# EAGLE design Pro Trinket Keyboard V4.2 (EAGLE 7.4.0)
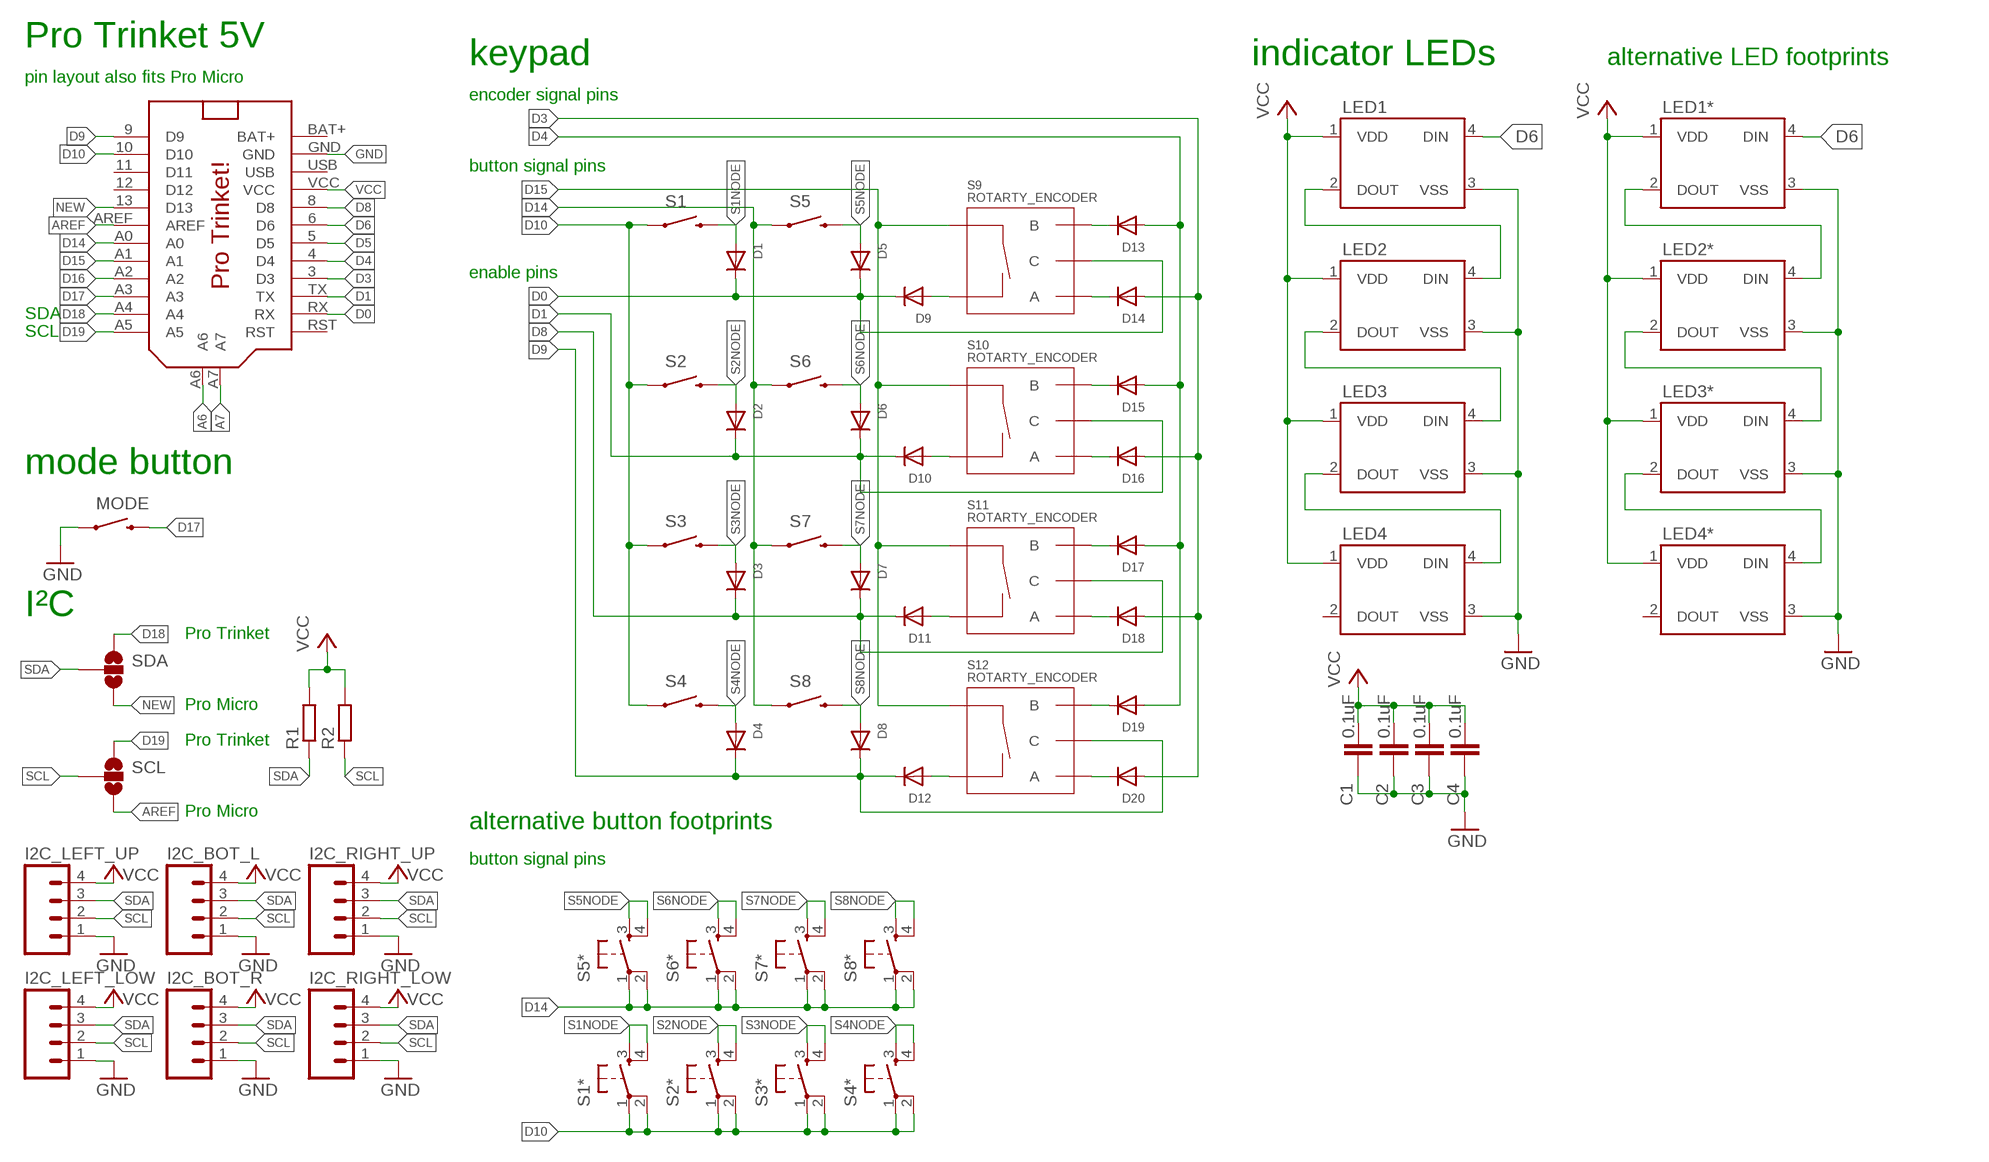
[diagram p0: schematic, sheet 1]

## Parts
C1  0.1uF  22PF-50V-5%(0603)  [0603-CAP]
C2  0.1uF  22PF-50V-5%(0603)  [0603-CAP]
C3  0.1uF  22PF-50V-5%(0603)  [0603-CAP]
C4  0.1uF  22PF-50V-5%(0603)  [0603-CAP]
D1  DIODESOD-123  [SOD-123]
D2  DIODESOD-123  [SOD-123]
D3  DIODESOD-123  [SOD-123]
D4  DIODESOD-123  [SOD-123]
D5  DIODESOD-123  [SOD-123]
D6  DIODESOD-123  [SOD-123]
D7  DIODESOD-123  [SOD-123]
D8  DIODESOD-123  [SOD-123]
D9  DIODESOD-123  [SOD-123]
D10  DIODESOD-123  [SOD-123]
D11  DIODESOD-123  [SOD-123]
D12  DIODESOD-123  [SOD-123]
D13  DIODESOD-123  [SOD-123]
D14  DIODESOD-123  [SOD-123]
D15  DIODESOD-123  [SOD-123]
D16  DIODESOD-123  [SOD-123]
D17  DIODESOD-123  [SOD-123]
D18  DIODESOD-123  [SOD-123]
D19  DIODESOD-123  [SOD-123]
D20  DIODESOD-123  [SOD-123]
I2C_BOT_L  M04PTH  [1X04]
I2C_BOT_R  M04PTH  [1X04]
I2C_LEFT_LOW  M04PTH  [1X04]
I2C_LEFT_UP  M04PTH  [1X04]
I2C_RIGHT_LOW  M04PTH  [1X04]
I2C_RIGHT_UP  M04PTH  [1X04]
LED1  WS2812B  [WS2812B]
LED1*  WS2812B  [WS2812B]
LED2  WS2812B  [WS2812B]
LED2*  WS2812B  [WS2812B]
LED3  WS2812B  [WS2812B]
LED3*  WS2812B  [WS2812B]
LED4  WS2812B  [WS2812B]
LED4*  WS2812B  [WS2812B]
MODE  SWITCH-MOMENTARY-2SIDE_EZ  [TACTILE-PTH-SIDEEZ]
PRO_TRINKET  PRO_TRINKET  [PROTRINKET]
R1  RESISTORR805-0805  [R805]
R2  RESISTORR805-0805  [R805]
S1  SWITCH-MOMENTARY-212MM  [TACTILE-PTH-12MM]
S1*  TACTILE-SWITCH-PTH  [TAC-SWITCH-PTH]
S2  SWITCH-MOMENTARY-212MM  [TACTILE-PTH-12MM]
S2*  TACTILE-SWITCH-PTH  [TAC-SWITCH-PTH]
S3  SWITCH-MOMENTARY-212MM  [TACTILE-PTH-12MM]
S3*  TACTILE-SWITCH-PTH  [TAC-SWITCH-PTH]
S4  SWITCH-MOMENTARY-212MM  [TACTILE-PTH-12MM]
S4*  TACTILE-SWITCH-PTH  [TAC-SWITCH-PTH]
S5  SWITCH-MOMENTARY-212MM  [TACTILE-PTH-12MM]
S5*  TACTILE-SWITCH-PTH  [TAC-SWITCH-PTH]
S6  SWITCH-MOMENTARY-212MM  [TACTILE-PTH-12MM]
S6*  TACTILE-SWITCH-PTH  [TAC-SWITCH-PTH]
S7  SWITCH-MOMENTARY-212MM  [TACTILE-PTH-12MM]
S7*  TACTILE-SWITCH-PTH  [TAC-SWITCH-PTH]
S8  SWITCH-MOMENTARY-212MM  [TACTILE-PTH-12MM]
S8*  TACTILE-SWITCH-PTH  [TAC-SWITCH-PTH]
S9  ROTARTY_ENCODER  [ROTARY_ENC_PLAIN]
S10  ROTARTY_ENCODER  [ROTARY_ENC_PLAIN]
S11  ROTARTY_ENCODER  [ROTARY_ENC_PLAIN]
S12  ROTARTY_ENCODER  [ROTARY_ENC_PLAIN]
SCL  SOLDERJUMPER_2WAYS  [SJ_3]
SDA  SOLDERJUMPER_2WAYS  [SJ_3]

## Nets
A6: PRO_TRINKET.A6
A7: PRO_TRINKET.A7
AREF: PRO_TRINKET.AREF SCL.3
D0: D1.C D5.C D9.C PRO_TRINKET.RX S9.C
D1: D2.C D6.C D10.C PRO_TRINKET.TX S10.C
D3: D14.A D16.A D18.A D20.A PRO_TRINKET.3(D3)
D4: D13.A D15.A D17.A D19.A PRO_TRINKET.4(D4)
D5: PRO_TRINKET.5(D5)
D6: LED1*.4(DIN) LED1.4(DIN) PRO_TRINKET.6(D6)
D8: D3.C D7.C D11.C PRO_TRINKET.8(D8) S11.C
D9: D4.C D8.C D12.C PRO_TRINKET.9(D9) S12.C
D10: PRO_TRINKET.10(D10) S1*.1 S1*.2 S1.1 S1.2 S2*.1 S2*.2 S2.1 S2.2 S3*.1 S3*.2 S3.1 S3.2 S4*.1 S4*.2 S4.1 S4.2
D14: PRO_TRINKET.A0 S5*.1 S5*.2 S5.1 S5.2 S6*.1 S6*.2 S6.1 S6.2 S7*.1 S7*.2 S7.1 S7.2 S8*.1 S8*.2 S8.1 S8.2
D15: PRO_TRINKET.A1 S9.SW+ S10.SW+ S11.SW+ S12.SW+
D16: PRO_TRINKET.A2
D17: MODE.2 PRO_TRINKET.A3
D18: PRO_TRINKET.A4 SDA.1
D19: PRO_TRINKET.A5 SCL.1
GND: C1.1 C2.1 C3.1 C4.1 I2C_BOT_L.1 I2C_BOT_R.1 I2C_LEFT_LOW.1 I2C_LEFT_UP.1 I2C_RIGHT_LOW.1 I2C_RIGHT_UP.1 LED1*.3(VSS) LED1.3(VSS) LED2*.3(VSS) LED2.3(VSS) LED3*.3(VSS) LED3.3(VSS) LED4*.3(VSS) LED4.3(VSS) MODE.1 PRO_TRINKET.GND
L1NODE: LED1*.2(DOUT) LED1.2(DOUT) LED2*.4(DIN) LED2.4(DIN)
L2NODE: LED2*.2(DOUT) LED2.2(DOUT) LED3*.4(DIN) LED3.4(DIN)
L3NODE: LED3*.2(DOUT) LED3.2(DOUT) LED4*.4(DIN) LED4.4(DIN)
N$34: D10.A S10.SW-
N$35: D9.A S9.SW-
N$36: D11.A S11.SW-
N$37: D20.C S12.A
N$38: D19.C S12.B
N$39: D18.C S11.A
N$40: D12.A S12.SW-
N$41: D16.C S10.A
N$42: D15.C S10.B
N$43: D14.C S9.A
N$44: D13.C S9.B
N$45: D17.C S11.B
NEW: PRO_TRINKET.13(D13) SDA.3
S1NODE: D1.A S1*.3 S1*.4 S1.3 S1.4
S2NODE: D2.A S2*.3 S2*.4 S2.3 S2.4
S3NODE: D3.A S3*.3 S3*.4 S3.3 S3.4
S4NODE: D4.A S4*.3 S4*.4 S4.3 S4.4
S5NODE: D5.A S5*.3 S5*.4 S5.3 S5.4
S6NODE: D6.A S6*.3 S6*.4 S6.3 S6.4
S7NODE: D7.A S7*.3 S7*.4 S7.3 S7.4
S8NODE: D8.A S8*.3 S8*.4 S8.3 S8.4
SCL: I2C_BOT_L.2 I2C_BOT_R.2 I2C_LEFT_LOW.2 I2C_LEFT_UP.2 I2C_RIGHT_LOW.2 I2C_RIGHT_UP.2 R2.1 SCL.2
SDA: I2C_BOT_L.3 I2C_BOT_R.3 I2C_LEFT_LOW.3 I2C_LEFT_UP.3 I2C_RIGHT_LOW.3 I2C_RIGHT_UP.3 R1.1 SDA.2
VCC: C1.2 C2.2 C3.2 C4.2 I2C_BOT_L.4 I2C_BOT_R.4 I2C_LEFT_LOW.4 I2C_LEFT_UP.4 I2C_RIGHT_LOW.4 I2C_RIGHT_UP.4 LED1*.1(VDD) LED1.1(VDD) LED2*.1(VDD) LED2.1(VDD) LED3*.1(VDD) LED3.1(VDD) LED4*.1(VDD) LED4.1(VDD) PRO_TRINKET.VCC R1.2 R2.2
Unconnected: LED4*.2(DOUT) LED4.2(DOUT) PRO_TRINKET.11(D11) PRO_TRINKET.12(D12) PRO_TRINKET.RST

## Notes on the sheet
- Pro Trinket 5V
- keypad | indicator LEDs | alternative LED footprints
- pin layout also fits Pro Micro
- encoder signal pins
- button signal pins
- enable pins
- SDA
- SCL
- mode button
- I²C
- Pro Trinket
- Pro Micro
- Pro Trinket
- Pro Micro
- alternative button footprints
- button signal pins

## Power pins joined to a net without a drawn wire
BAT+: PRO_TRINKET.BAT+
USB: PRO_TRINKET.USB

## Library data of the parts
C1-C4 = SparkFun-Capacitors:22PF-50V-5%(0603): CAP-07876; PROD_ID: CAP-07876; VALUE: 22pF
D1-D20 = adafruit:DIODE: Diode SMADIODE - SMA Surface Mount Package 20V 1A Schottky Diode Digikey: 641-1014-6-ND DO-1N4148 - Through Hole Small Current Diode SOD-123 20V 1 A (.5mV Vf) Schottky Diode - Digikey: MBRX120TPMSCT-ND SOD-323 10V 570mA (.38mV Vf, 3ns) Schottky Diode - Digikey: ZLLS410CT-ND SOD-523 30V 30mA Schottky Diode (RB751S-40TE61) - Digikey: RB751S-40TE61CT-ND SOT23-R/W - SOT23 Package (R = Solder Paste/Reflow Ovens, W = Hand-Soldering) BAT54Film 40V 300mA - Digikey: 497-7162-1-ND
I2C_BOT_L I2C_BOT_R I2C_LEFT_LOW I2C_LEFT_UP I2C_RIGHT_LOW I2C_RIGHT_UP = SparkFun-Connectors:M04: Header 4 Standard 4-pin 0.1" header. Use with straight break away headers (SKU : PRT-00116), right angle break away headers (PRT-00553), swiss pins (PRT-00743), machine pins (PRT-00117), and female headers (PRT-00115). Molex polarized connector foot print use with SKU : PRT-08231 with associated crimp pins and housings. 1MM SMD Version SKU: PRT-10208
LED1 LED1* LED2 LED2* LED3 LED3* LED4 LED4* = SparkFun-LED:WS2812B: WS2812B - Intelligent control LED integrated light source Technical Specifications: Power Supply Voltage (VDD): 3.5 to 5.3 V Input Voltage (VI): -0.5 to VDD+0.5 V Operating Junction Temperature (Topt): -25°C to +80°C Storage Temperature Range (Tstg): -55°C to +150°C
MODE = SparkFun-Electromechanical:SWITCH-MOMENTARY-2: Various NO switches- pushbuttons, reed, etc
PRO_TRINKET = adafruit:PRO_TRINKET
R1 R2 = dp_devices:RESISTOR
S1-S8 = SparkFun-Electromechanical:SWITCH-MOMENTARY-2: Various NO switches- pushbuttons, reed, etc; PROD_ID: SWCH-09185
S1* S2* S3* S4* S5* S6* S7* S8* = GeekAmmo:TACTILE-SWITCH: Tactile Switch 4 Pins, SPST NO
S9-S12 = SparkFun-Electromechanical:ROTARTY_ENCODER: Simple no LED rotary encoder Example: COM-09117
SCL SDA = SparkFun-Retired:SOLDERJUMPER_2WAY: Solder Jumper 2 way solder jumper

## Board
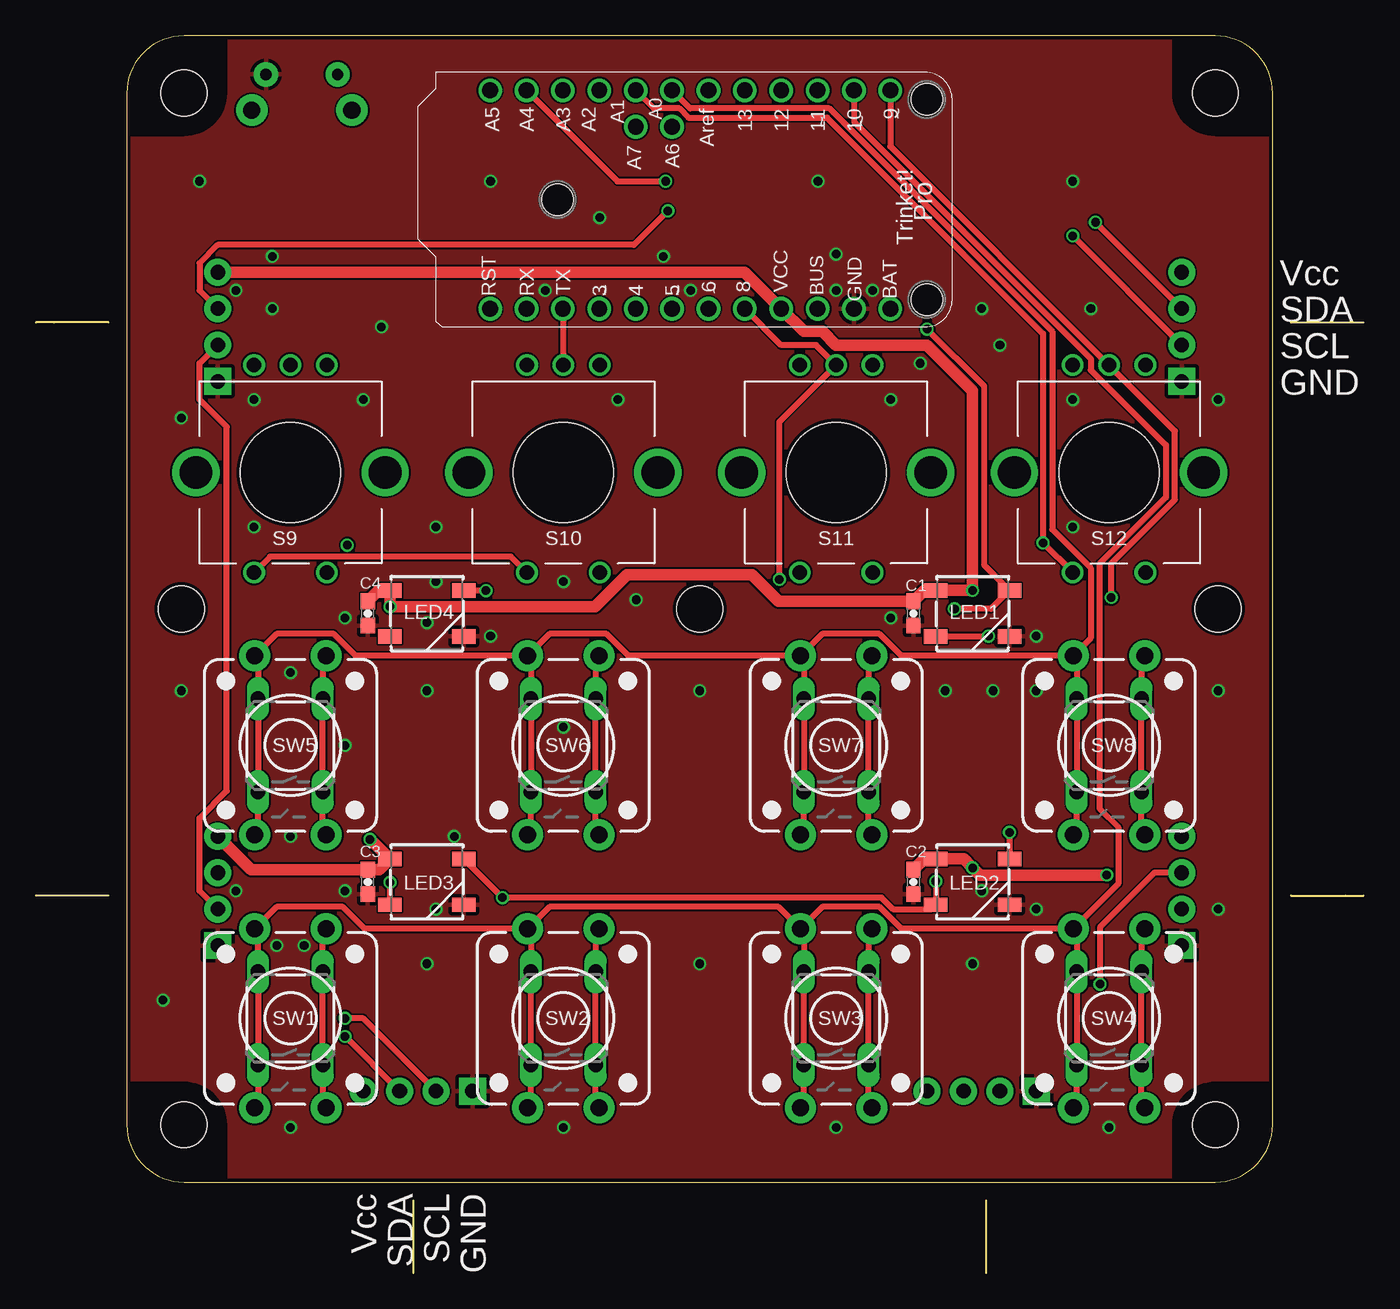
[diagram p1: board, top side]
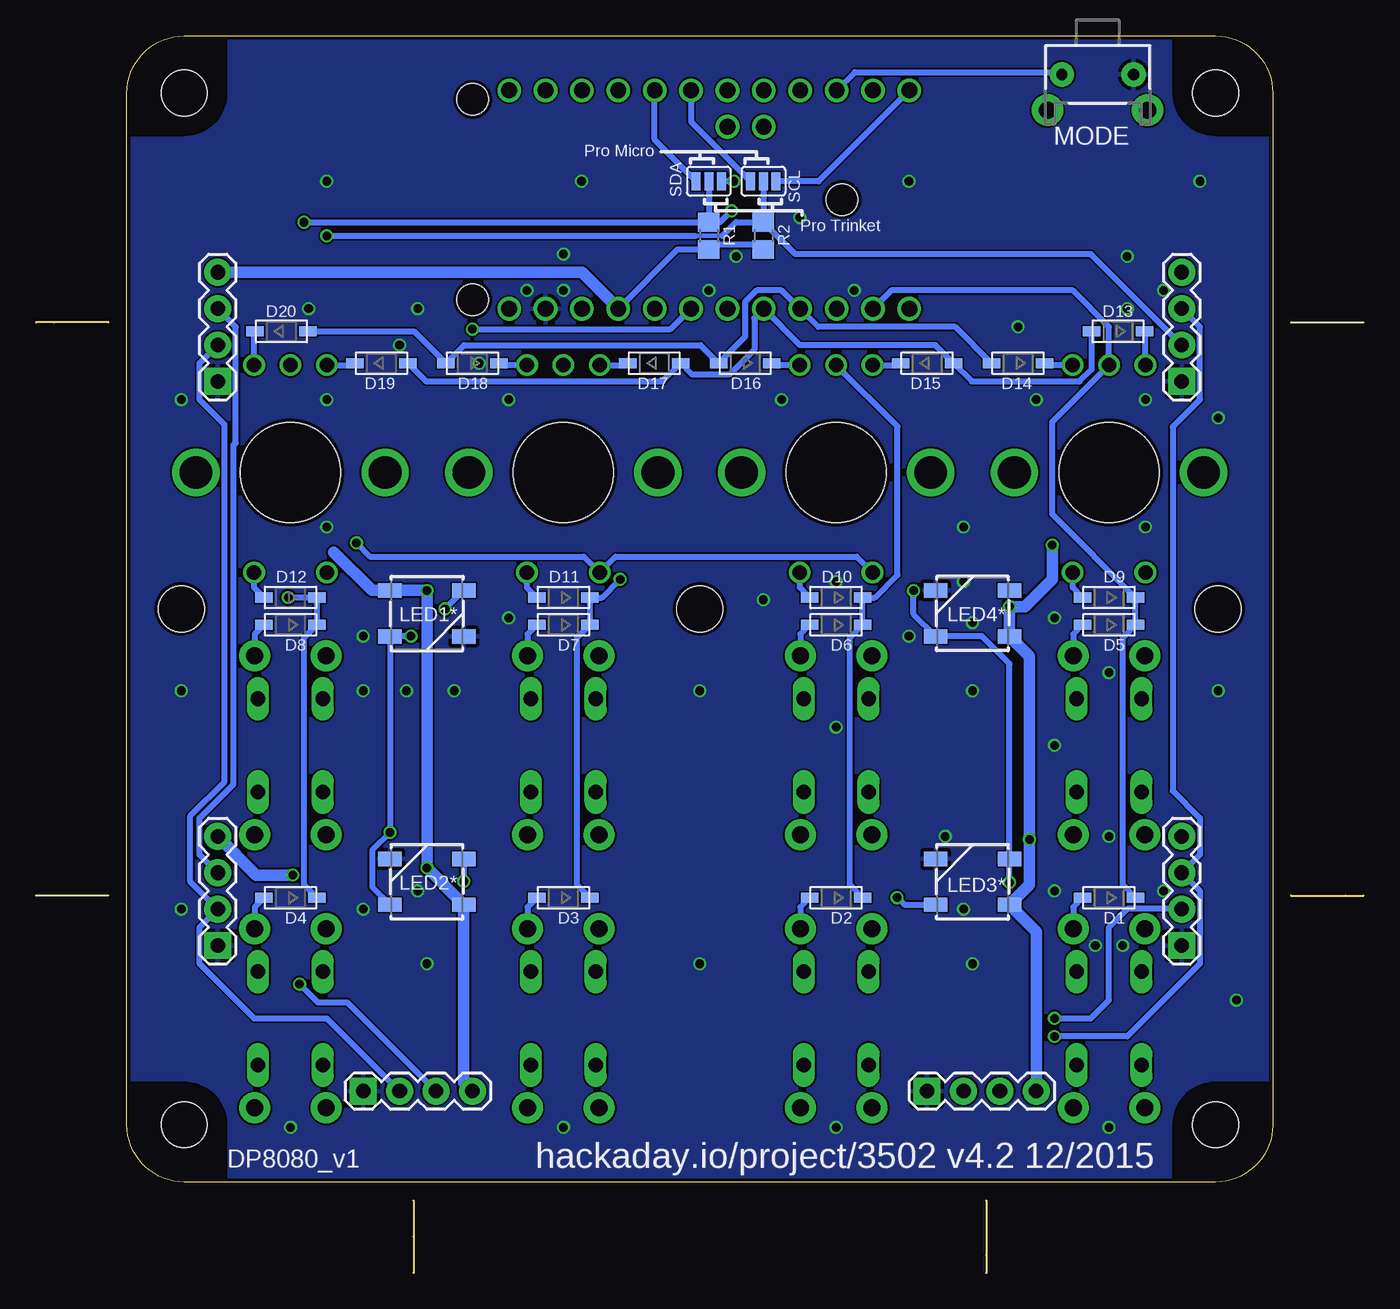
[diagram p2: board, bottom side, seen from below]

Size 80 x 80 mm. Coordinates in mm from the lower left corner, seen from the top.
Copper layers (1*16): Top 0.035mm / dielectric 1.5mm / Bottom 0.035mm
Design rules "dirt_cheap_dirty_boards.v1": minimum track width 5mil, minimum drill 12mil, track to track 5mil, track to pad 5mil, pad to pad 5mil, via to via 5mil, smd to smd 0mil, copper to edge 10mil, drill to drill 10mil, minimum pad ring 10mil, minimum via ring 6mil, stop-mask expansion 2mil, vias tented up to drill 25mil, thermal gap 10mil
Holes 7 mm at 11.43,49.53 30.48,49.53 49.53,49.53 68.58,49.53
Holes 3.2 mm at 40.01,40.01 3.81,40.01 76.2,40.01

### Footprints (pad centres in the part's own frame; a part is rotated, then mirrored left to right if it is on the bottom)
0603-CAP = smd 1.1 x 1: 1 -0.85,0; 2 0.85,0
SOD-123 = smd 1.2 x 0.7: A 1.85,0; C -1.85,0
1X04 = drill 1.016 pad 1.88 square: 1 0,0 | drill 1.016 pad 1.88: 2 2.54,0; 3 5.08,0; 4 7.62,0
WS2812B = smd 1.651 x 1: 1 -2.577,1.6; 2 -2.577,-1.6; 3 2.577,-1.6; 4 2.577,1.6
TACTILE-PTH-SIDEEZ = drill 0.8 pad 1.7: 1 -2.5,0; 2 2.5,0 | drill 1.2 pad 2.2: ANCHOR1 -3.5,2.5; ANCHOR2 3.5,2.5
PROTRINKET = drill 1.1: 3 7.62,2.921; 4 7.62,5.461; 5 7.62,8.001; 6 7.62,10.541; 8 7.62,13.081; 9 -7.62,23.241; 10 -7.62,20.701; 11 -7.62,18.161; 12 -7.62,15.621; 13 -7.62,13.081; A0 -7.62,8.001; A1 -7.62,5.461; A2 -7.62,2.921; A3 -7.62,0.381; A4 -7.62,-2.159; A5 -7.62,-4.699; A6 -5.08,8.001; A7 -5.08,5.461; AREF -7.62,10.541; BAT+ 7.62,23.241; GND 7.62,20.701; RST 7.62,-4.699; RX 7.62,-2.159; TX 7.62,0.381; USB 7.62,18.161; VCC 7.62,15.621 | hole 2.2: -6.985,25.781; 6.985,25.781; 0,0
R805 = smd 1.3 x 1.5: 1 -0.95,0; 2 0.95,0
TACTILE-PTH-12MM = drill 1.2 pad 2.159: 1 6.25,-2.5; 2 -6.25,-2.5; 3 6.25,2.5; 4 -6.25,2.5
TAC-SWITCH-PTH = drill 1.016 pad 1.524 long: 1 -3.251,2.261; 2 3.251,2.261; 3 -3.251,-2.261; 4 3.251,-2.261
ROTARY_ENC_PLAIN = drill 1.016: A 7.493,-2.54; B 7.493,2.54; C 7.493,0; SW+ -6.985,2.54; SW- -6.985,-2.54 | drill 2.286: P$3 0,6.604; P$4 0,-6.604
SJ_3 = smd 0.635 x 1.27: 1 -0.889,0; 2 0,0; 3 0.889,0
DP8080_V1 = hole 3.2: 4,4; 76,4; 76,76; 4,76

### Placement (x,y rotation side)
C1  54.93,39.69 90 top
C2  54.93,20.95 90 top
C3  16.83,20.95 90 top
C4  16.83,39.69 90 top
D1  11.43,19.84 180 bottom
D2  30.48,19.84 180 bottom
D3  49.53,19.84 180 bottom
D4  68.58,19.84 180 bottom
D5  11.43,38.89 180 bottom
D6  30.48,38.89 180 bottom
D7  49.53,38.89 180 bottom
D8  68.58,38.89 180 bottom
D9  11.43,40.8 180 bottom
D10  30.48,40.8 180 bottom
D11  49.53,40.8 180 bottom
D12  68.58,40.8 180 bottom
D13  10.79,59.37 180 bottom
D14  17.78,57.15 180 bottom
D15  24.13,57.15 0 bottom
D16  36.83,57.15 180 bottom
D17  43.18,57.15 0 bottom
D18  55.88,57.15 180 bottom
D19  62.23,57.15 0 bottom
D20  69.22,59.37 0 bottom
I2C_BOT_L  24.13,6.35 0 bottom
I2C_BOT_R  63.5,6.35 0 bottom
I2C_LEFT_LOW  6.35,16.51 90 bottom
I2C_LEFT_UP  6.35,55.88 90 bottom
I2C_RIGHT_LOW  73.66,16.51 90 bottom
I2C_RIGHT_UP  73.66,55.88 90 bottom
LED1  59.05,39.69 0 top
LED1*  59.05,39.69 0 bottom
LED2  59.05,20.95 0 top
LED2*  59.05,20.95 180 bottom
LED3  20.95,20.95 0 top
LED3*  20.95,20.95 180 bottom
LED4  20.95,39.69 0 top
LED4*  20.95,39.69 180 bottom
MODE  12.22,77.31 180 bottom
PRO_TRINKET  30.07,68.57 270 top
R1  39.37,66.04 270 bottom
R2  35.56,66.04 270 bottom
S1  11.43,11.43 270 top
S1*  11.43,11.43 90 top
S2  30.48,11.43 270 top
S2*  30.48,11.43 90 top
S3  49.53,11.43 270 top
S3*  49.53,11.43 90 top
S4  68.58,11.43 270 top
S4*  68.58,11.43 90 top
S5  11.43,30.48 270 top
S5*  11.43,30.48 90 top
S6  30.48,30.48 270 top
S6*  30.48,30.48 90 top
S7  49.53,30.48 270 top
S7*  49.53,30.48 90 top
S8  68.58,30.48 270 top
S8*  68.58,30.48 90 top
S9  11.43,49.53 90 top
S10  30.48,49.53 90 top
S11  49.53,49.53 90 top
S12  68.58,49.53 90 top
SCL  35.56,69.85 180 bottom
SDA  39.37,69.85 180 bottom
U$1  [DP8080_V1]  0,0 0 top

### Tracks (layer width: path | path; a pad name or v marks a point on that pad's centre or on a via)
AREF
  Bottom 0.406: PRO_TRINKET.AREF 40.61,74.01 SCL.3
D0
  Bottom 0.406: D1.C 10.48,20.74 10.48,38 D5.C D9.C 15.4,46.62 15.4,53.05 S9.C 11.43,59.69 13.97,62.23 26.64,62.23 PRO_TRINKET.RX
D1
  Top 0.406: PRO_TRINKET.TX 30.45,57.05 S10.C
  Bottom 0.406: D2.C 29.53,20.74 29.53,38 D6.C D10.C 27.78,40.8 26.19,42.39 26.19,52.74 S10.C
D3
  Bottom 0.406: D20.A 59.95,59.37 D18.A 56.46,58.42 39.95,58.42 D16.A 36.83,59 36.83,61.44 36.04,62.23 34.29,62.23 33.01,60.95 PRO_TRINKET.3 31.73,59.69 22.17,59.69 D14.A
D4
  Bottom 0.406: D19.A 59.11,55.88 42.6,55.88 D17.A 40.54,56.36 37.94,56.36 36.2,58.1 36.2,60.29 PRO_TRINKET.4 33,58.42 23.55,58.42 D15.A 21.01,55.88 13.49,55.88 12.64,56.73 D13.A
D6  (via drill 0.6)
  Top 0.406: v57.78,40.01 60.35,40.01 LED1.4 59.85,43.07 59.85,55.56 v55.88,59.53
  Bottom 0.406: v57.78,40.01 56.5,41.29 LED1*.4 | v55.88,59.53 42.03,59.53 PRO_TRINKET.6
D8  (via drill 0.6)
  Top 0.406: v45.56,42.07 45.56,53.05 S11.C 48.13,58.42 45.69,58.42 PRO_TRINKET.8
  Bottom 0.406: D3.C 48.58,20.74 48.58,38 D7.C D11.C 46.83,40.8 v45.56,42.07
D9  (via drill 0.6)
  Top 0.406: PRO_TRINKET.9 53.31,72.29 S12.C 73.18,52.42 73.18,47.62 68.74,43.18 v68.74,40.8
  Bottom 0.406: D4.C 67.63,20.74 67.63,38 D8.C D12.C v68.74,40.8
D10
  Top 0.406: S2.1 28.22,5.42 S2*.1 S2*.2 28.22,17.44 S2.2 | S3.1 47.27,5.42 S3*.1 S3*.2 47.27,17.44 S3.2 | S4.1 66.32,5.42 S4*.1 S4*.2 66.32,17.44 S4.2 | S4.2 54.08,17.68 52.55,19.21 48.56,19.21 S3.2 | S3.2 45.5,19.21 29.51,19.21 S2.2 | S2.2 16.61,17.68 15.08,19.21 10.46,19.21 S1.2 9.17,17.44 S1*.2 S1*.1 9.17,5.42 S1.1 | PRO_TRINKET.10 50.77,74.01 67.31,57.47 67.31,56.67 72.55,51.44 72.55,47.78 67.94,43.18 67.94,26.04 69.22,24.77 69.22,20.82 S4.2
D14
  Top 0.406: S8.2 66.32,36.49 S8*.2 S8*.1 66.32,24.47 S8.1 | S7.2 47.27,36.49 S7*.2 S7*.1 47.27,24.47 S7.1 | S6.2 28.22,36.49 S6*.2 S6*.1 28.22,24.47 S6.1 | S5.1 9.17,24.47 S5*.1 S5*.2 9.17,36.49 S5.2 10.46,38.26 14.45,38.26 15.97,36.73 S6.2 | S8.2 54.08,36.73 52.55,38.26 48.56,38.26 S7.2 | S7.2 35.02,36.73 33.5,38.26 29.51,38.26 S6.2 | S8.2 67.31,37.96 67.31,42.86 64.61,45.56 64.61,59.37 49.05,74.93 39.34,74.93 PRO_TRINKET.A0
D15  (via drill 0.6)
  Top 0.406: S12.SW+ v63.98,44.61 63.98,59.21 48.9,74.3 39.21,74.3 38.58,74.93 36.8,74.93 PRO_TRINKET.A1 | S10.SW+ 26.83,43.66 10,43.66 S9.SW+
  Bottom 0.406: S10.SW+ 29.05,43.66 45.88,43.66 S11.SW+ 48.1,43.66 63.02,43.66 v63.98,44.61
D17
  Bottom 0.406: PRO_TRINKET.A3 29.18,77.47 14.88,77.47 MODE.2
D18  (via drill 0.6)
  Top 0.406: PRO_TRINKET.A4 34.26,69.85 v37.62,69.85
  Bottom 0.406: v37.62,69.85 SDA.1
D19
  Bottom 0.406: PRO_TRINKET.A5 31.71,69.85 SCL.1
GND  (via drill 0.6)
  other vias: 53.34,54.61 60.96,58.42 55.4,57.15 66.04,54.61 34.29,54.61 16.51,54.61 25.4,69.85 5.08,69.85 48.26,69.85 66.04,69.85 3.81,53.34 76.2,54.61 35.56,40.64 15.24,39.37 21.59,41.91 25.4,38.1 20.95,34.29 40.01,34.29 57.15,34.29 60.48,34.29 63.5,34.29 63.5,38.1 53.34,39.37 76.2,34.29 63.5,19.05 59.69,20.32 76.2,19.05 59.05,15.24 40.01,15.24 20.95,15.24 68.58,3.81 49.53,3.81 30.48,3.81 11.43,3.81 2.54,12.7 3.81,34.29 21.59,19.05 15.24,20.32 22.86,24.13 20.95,39.05 30.48,41.91 49.53,64.77 33.02,67.31 17.78,59.69 59.69,60.96 67.31,60.96 66.04,45.72 12.38,16.51 10.48,16.51 7.62,20.32 11.43,24.13 11.43,35.56 15.24,30.48 30.48,31.75 21.59,45.72 8.89,54.61 8.89,45.72 7.62,62.23 49.53,62.23 52.07,62.23 10.16,60.96 10.16,64.61 39.37,62.23 29.21,62.23 37.47,64.61
  pour Bottom (rank 6): 0,80.01 80.01,80.01 80.01,0 0,0
  pour Top: 0,80.01 80.01,80.01 80.01,0 0,0
L1NODE  (via drill 0.6)
  Top 0.406: LED1.2 v60.17,38.1 | v61.63,24.41 LED2.4
  Bottom 0.406: v60.17,38.1 LED1*.2 v61.63,24.41 62.87,23.18 62.87,20.59 LED2*.4
L2NODE  (via drill 0.6)
  Top 0.406: v56.48,20.99 LED2.2 56.17,19.05 53.5,19.05 52.69,19.86 v26.23,19.86 LED3.4
  Bottom 0.406: LED2*.2 v56.48,20.99 | v26.23,19.86 25.73,19.36 LED3*.4
L3NODE  (via drill 0.6)
  Top 0.406: LED3.2 v18.38,20.92 | v25.08,41.27 23.54,41.27 LED4.4
  Bottom 0.406: v18.38,20.92 LED3*.2 18.38,36.16 20.32,38.1 LED4*.4 25.08,39.64 v25.08,41.27
N$34
  Bottom 0.406: D10.A 33.02,41.49 S10.SW-
N$35
  Bottom 0.406: D9.A 13.97,41.49 S9.SW-
N$36
  Bottom 0.406: D11.A 52.07,41.49 S11.SW-
N$37
  Bottom 0.406: S12.A 71.12,59.32 D20.C
N$38
  Bottom 0.406: S12.B 64.21,57.02 D19.C
N$39
  Bottom 0.406: S11.A 53.9,57.02 D18.C
N$40
  Bottom 0.406: D12.A 71.12,41.49 S12.SW-
N$41
  Bottom 0.406: S10.A 34.85,57.02 D16.C
N$42
  Bottom 0.406: S10.B 26.11,57.02 D15.C
N$43
  Bottom 0.406: S9.A 15.8,57.02 D14.C
N$44
  Bottom 0.406: S9.B 8.89,59.32 D13.C
N$45
  Bottom 0.406: S11.B 45.16,57.02 D17.C
NEW
  Bottom 0.406: SDA.3 43.15,72.74 PRO_TRINKET.13
S1NODE
  Top 0.406: S1.3 13.69,5.42 S1*.3 S1*.4 13.69,17.44 S1.4
  Bottom 0.406: D1.A 13.93,19.19 S1.4
S2NODE
  Top 0.406: S2.3 32.74,5.42 S2*.3 S2*.4 32.74,17.44 S2.4
  Bottom 0.406: D2.A 32.98,19.19 S2.4
S3NODE
  Top 0.406: S3.3 51.79,5.42 S3*.3 S3*.4 51.79,17.44 S3.4
  Bottom 0.406: D3.A 52.03,19.19 S3.4
S4NODE
  Top 0.406: S4.3 70.84,5.42 S4*.3 S4*.4 70.84,17.44 S4.4
  Bottom 0.406: D4.A 71.08,19.19 S4.4
S5NODE
  Top 0.406: S5.3 13.69,24.47 S5*.3 S5*.4 13.69,36.49 S5.4
  Bottom 0.406: D5.A 13.93,38.24 S5.4
S6NODE
  Top 0.406: S6.3 32.74,24.47 S6*.3 S6*.4 32.74,36.49 S6.4
  Bottom 0.406: D6.A 32.98,38.24 S6.4
S7NODE
  Top 0.406: S7.3 51.79,24.47 S7*.3 S7*.4 51.79,36.49 S7.4
  Bottom 0.406: D7.A 52.03,38.24 S7.4
S8NODE
  Top 0.406: S8.3 70.84,24.47 S8*.3 S8*.4 70.84,36.49 S8.4
  Bottom 0.406: D8.A 71.08,38.24 S8.4
SCL  (via drill 0.6)
  Top 0.406: v66.04,66.04 I2C_RIGHT_UP.2 | I2C_BOT_L.2 16.51,11.43 v15.24,11.43 | I2C_LEFT_LOW.2 5.08,20.32 5.08,25.4 6.99,27.3 6.99,52.7 5.08,54.61 5.08,57.15 I2C_LEFT_UP.2
  Bottom 0.305: 40.32,66.04 38.42,66.04
  Bottom 0.406: SCL.2 R2.1 | v66.04,66.04 40.32,66.04 | 38.42,66.04 37.47,66.99 R2.1 | R2.1 33.34,64.77 12.7,64.77 I2C_LEFT_UP.2 | I2C_BOT_R.2 66.04,11.43 71.12,11.43 74.93,15.24 74.93,17.78 I2C_RIGHT_LOW.2 75.56,20.95 75.56,25.56 73.18,27.94 73.18,52.86 74.93,54.61 74.93,57.15 I2C_RIGHT_UP.2 | v15.24,11.43 12.7,11.43 11.43,12.7 11.43,17.78 10.11,19.1 6.4,19.1 I2C_LEFT_LOW.2
SDA  (via drill 0.6)
  Top 0.406: I2C_RIGHT_LOW.3 71.75,21.59 67.94,17.78 v67.94,13.81 | v67.63,66.99 I2C_RIGHT_UP.3 | v15.24,10.16 I2C_BOT_L.3 | v37.78,67.79 35.4,65.41 6.35,65.41 5.08,64.14 5.08,62.23 I2C_LEFT_UP.3
  Bottom 0.406: SDA.2 R1.1 | v67.63,66.99 R1.1 | v37.78,67.79 38.58,66.99 R1.1 | v67.94,13.81 66.67,12.54 64.61,12.54 I2C_BOT_R.3 | I2C_RIGHT_LOW.3 74.93,22.86 74.93,25.4 72.55,27.78 72.55,51.44 72.39,51.59 72.39,59.69 I2C_RIGHT_UP.3 | v15.24,10.16 10.16,10.16 5.08,15.24 5.08,20.32 I2C_LEFT_LOW.3 5.08,22.86 5.08,25.4 6.99,27.3 6.99,52.7 5.08,54.61 5.08,59.69 I2C_LEFT_UP.3
VCC  (via drill 0.6)
  Top 0.813: C4.2 17.58,41.29 LED4.1 v18.38,40.16 32.7,40.16 34.92,42.39 43.66,42.39 45.51,40.54 C1.2 55.68,41.29 LED1.1 v59.05,41.29 59.05,55.24 55.88,58.42 49.53,58.42 48.58,59.37 47.27,59.37 PRO_TRINKET.VCC 43.15,63.5 I2C_LEFT_UP.4 | C2.2 55.68,22.55 LED2.1 58.43,22.55 v59.05,21.93 59.56,21.43 v68.42,21.43 | v16.99,23.92 18.35,22.55 LED3.1 17.63,21.8 C3.2 8.68,21.8 I2C_LEFT_LOW.4
  Bottom 0.406: PRO_TRINKET.VCC 41.55,65.09 R1.2 39.05,65.41 35.88,65.41 R2.2
  Bottom 0.813: 65.56,43.97 62.88,41.29 LED1*.1 v59.05,41.29 v59.05,21.93 LED2*.1 56.48,6.95 I2C_BOT_R.4 | v15.4,44.45 15.4,42.07 17.3,40.16 v18.38,40.16 LED4*.1 16.99,36.7 v16.99,23.92 16.99,20.75 LED3*.1 16.51,17.49 I2C_BOT_L.4 | v68.42,21.43 70.96,21.43 I2C_RIGHT_LOW.4 | I2C_RIGHT_UP.4 48.24,63.5 PRO_TRINKET.VCC

### Text on the board
bPlace: Pro Micro | Pro Trinket
tNames: Vcc / SDA / SCL / GND | SW5 | SW6 | SW7 | SW8 | SW1 | SW2 | SW3 | SW4 | Vcc / SDA / SCL / GND
bNames: hackaday.io/project/3502 v4.2 12/2015